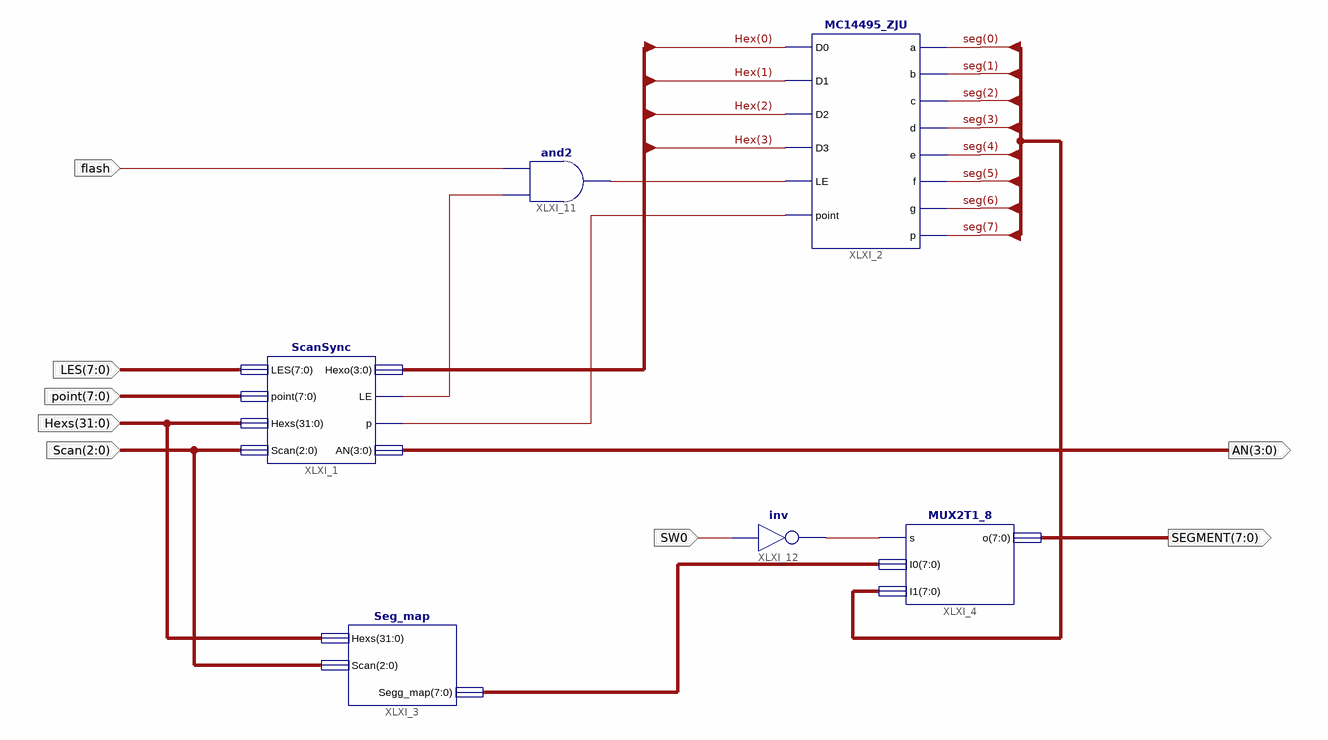
[diagram p0: schematic sheet 1]
// Xilinx ISE schematic Seg7_Dev.sch (kintex7) as structural Verilog: 6 symbols, 8 ports
module Seg7_Dev (
  input  [2:0] Scan,
  input  [31:0] Hexs,
  input  [7:0] point,
  input  [7:0] LES,
  input  flash,
  input  SW0,
  output [3:0] AN,
  output [7:0] SEGMENT
);

  wire XLXN_30, XLXN_31, XLXN_32, XLXN_34;
  wire [3:0] Hex;
  wire [7:0] seg, XLXN_33;

  ScanSync XLXI_1 (.LES(LES), .point(point), .Hexs(Hexs), .Scan(Scan), .Hexo(Hex), .LE(XLXN_32), .p(XLXN_30), .AN(AN));
  MC14495_ZJU XLXI_2 (
    .D0(Hex[0]), .D1(Hex[1]), .D2(Hex[2]), .D3(Hex[3]), .LE(XLXN_31), .point(XLXN_30), .a(seg[0]),
    .b(seg[1]), .c(seg[2]), .d(seg[3]), .e(seg[4]), .f(seg[5]), .g(seg[6]), .p(seg[7]));
  Seg_map XLXI_3 (.Hexs(Hexs), .Scan(Scan), .Segg_map(XLXN_33));
  MUX2T1_8 XLXI_4 (.s(XLXN_34), .I0(XLXN_33), .I1(seg), .o(SEGMENT));
  and XLXI_11 (XLXN_31, XLXN_32, flash);
  not XLXI_12 (XLXN_34, SW0);
endmodule
